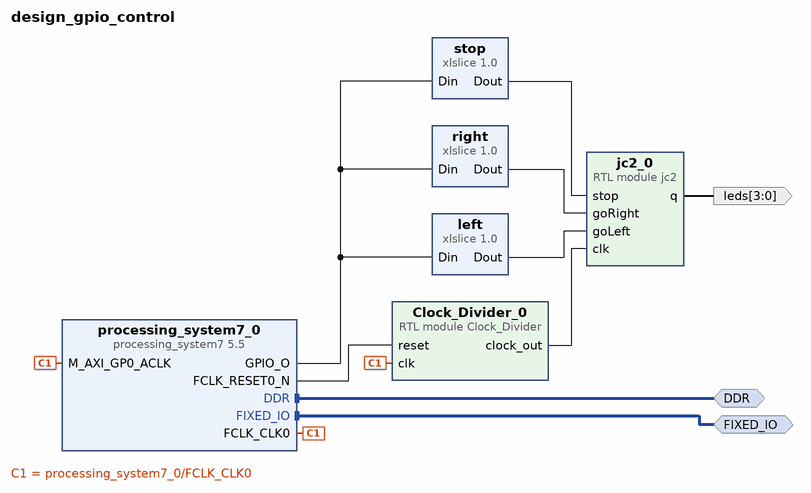
[diagram p0: block diagram of the top level]
# Vivado block design design_gpio_control, xc7z020clg400-1, Vivado 2019.1
create_bd_design design_gpio_control

create_bd_intf_port -mode Master -vlnv xilinx.com:interface:ddrx_rtl:1.0 DDR
create_bd_intf_port -mode Master -vlnv xilinx.com:display_processing_system7:fixedio_rtl:1.0 FIXED_IO
create_bd_port -dir O -from 3 -to 0 leds

create_bd_cell -type ip -vlnv xilinx.com:ip:processing_system7:5.5 processing_system7_0
set_property -dict [list \
  CONFIG.PCW_APU_PERIPHERAL_FREQMHZ 650 \
  CONFIG.PCW_CRYSTAL_PERIPHERAL_FREQMHZ 50 \
  CONFIG.PCW_ENET0_ENET0_IO {MIO 16 .. 27} \
  CONFIG.PCW_ENET0_GRP_MDIO_ENABLE 1 \
  CONFIG.PCW_ENET0_GRP_MDIO_IO {MIO 52 .. 53} \
  CONFIG.PCW_ENET0_PERIPHERAL_ENABLE 1 \
  CONFIG.PCW_ENET0_RESET_ENABLE 1 \
  CONFIG.PCW_ENET0_RESET_IO {MIO 9} \
  CONFIG.PCW_ENET_RESET_ENABLE 1 \
  CONFIG.PCW_ENET_RESET_SELECT {Share reset pin} \
  CONFIG.PCW_FPGA0_PERIPHERAL_FREQMHZ 100 \
  CONFIG.PCW_FPGA1_PERIPHERAL_FREQMHZ 50 \
  CONFIG.PCW_GPIO_EMIO_GPIO_ENABLE 1 \
  CONFIG.PCW_GPIO_EMIO_GPIO_IO 64 \
  CONFIG.PCW_GPIO_MIO_GPIO_ENABLE 1 \
  CONFIG.PCW_GPIO_MIO_GPIO_IO MIO \
  CONFIG.PCW_I2C_RESET_ENABLE 1 \
  CONFIG.PCW_M_AXI_GP0_FREQMHZ 10 \
  CONFIG.PCW_PERIPHERAL_BOARD_PRESET None \
  CONFIG.PCW_PRESET_BANK1_VOLTAGE {LVCMOS 1.8V} \
  CONFIG.PCW_QSPI_GRP_FBCLK_ENABLE 1 \
  CONFIG.PCW_QSPI_GRP_FBCLK_IO {MIO 8} \
  CONFIG.PCW_QSPI_GRP_SINGLE_SS_ENABLE 1 \
  CONFIG.PCW_QSPI_GRP_SINGLE_SS_IO {MIO 1 .. 6} \
  CONFIG.PCW_QSPI_PERIPHERAL_ENABLE 1 \
  CONFIG.PCW_QSPI_QSPI_IO {MIO 1 .. 6} \
  CONFIG.PCW_SD0_GRP_CD_ENABLE 1 \
  CONFIG.PCW_SD0_GRP_CD_IO {MIO 47} \
  CONFIG.PCW_SD0_GRP_WP_ENABLE 0 \
  CONFIG.PCW_SD0_PERIPHERAL_ENABLE 1 \
  CONFIG.PCW_SD0_SD0_IO {MIO 40 .. 45} \
  CONFIG.PCW_SDIO_PERIPHERAL_FREQMHZ 50 \
  CONFIG.PCW_SINGLE_QSPI_DATA_MODE x4 \
  CONFIG.PCW_UART0_PERIPHERAL_ENABLE 1 \
  CONFIG.PCW_UART0_UART0_IO {MIO 14 .. 15} \
  CONFIG.PCW_UART1_PERIPHERAL_ENABLE 0 \
  CONFIG.PCW_UART_PERIPHERAL_FREQMHZ 100 \
  CONFIG.PCW_UIPARAM_DDR_BUS_WIDTH {16 Bit} \
  CONFIG.PCW_UIPARAM_DDR_FREQ_MHZ 525 \
  CONFIG.PCW_UIPARAM_DDR_PARTNO {MT41J256M16 RE-125} \
  CONFIG.PCW_USB0_PERIPHERAL_ENABLE 1 \
  CONFIG.PCW_USB0_RESET_ENABLE 1 \
  CONFIG.PCW_USB0_RESET_IO {MIO 46} \
  CONFIG.PCW_USB0_USB0_IO {MIO 28 .. 39} \
  CONFIG.PCW_USB_RESET_ENABLE 1 \
  CONFIG.PCW_USB_RESET_SELECT {Share reset pin} \
] [get_bd_cells processing_system7_0]
# 481 more settings of processing_system7_0 are not shown: defaults, MIO pin electricals, DDR timing, and values the tool derives
create_bd_cell -type module -reference jc2 jc2_0
create_bd_cell -type module -reference Clock_Divider Clock_Divider_0
create_bd_cell -type ip -vlnv xilinx.com:ip:xlslice:1.0 left
set_property -dict {CONFIG.DIN_FROM 0 CONFIG.DIN_TO 0 CONFIG.DIN_WIDTH 64} [get_bd_cells left]
create_bd_cell -type ip -vlnv xilinx.com:ip:xlslice:1.0 right
set_property -dict {CONFIG.DIN_FROM 1 CONFIG.DIN_TO 1 CONFIG.DIN_WIDTH 64 CONFIG.DOUT_WIDTH 1} [get_bd_cells right]
create_bd_cell -type ip -vlnv xilinx.com:ip:xlslice:1.0 stop
set_property -dict {CONFIG.DIN_FROM 2 CONFIG.DIN_TO 2 CONFIG.DIN_WIDTH 64 CONFIG.DOUT_WIDTH 1} [get_bd_cells stop]

# ---- connections ----

connect_bd_intf_net [get_bd_intf_ports DDR] [get_bd_intf_pins processing_system7_0/DDR]
connect_bd_intf_net [get_bd_intf_ports FIXED_IO] [get_bd_intf_pins processing_system7_0/FIXED_IO]
connect_bd_net [get_bd_pins jc2_0/q] [get_bd_ports leds]
connect_bd_net [get_bd_pins processing_system7_0/FCLK_CLK0] [get_bd_pins Clock_Divider_0/clk] [get_bd_pins processing_system7_0/M_AXI_GP0_ACLK]
connect_bd_net [get_bd_pins processing_system7_0/FCLK_RESET0_N] [get_bd_pins Clock_Divider_0/reset]
connect_bd_net [get_bd_pins Clock_Divider_0/clock_out] [get_bd_pins jc2_0/clk]
connect_bd_net [get_bd_pins processing_system7_0/GPIO_O] [get_bd_pins left/Din] [get_bd_pins right/Din] [get_bd_pins stop/Din]
connect_bd_net [get_bd_pins left/Dout] [get_bd_pins jc2_0/goLeft]
connect_bd_net [get_bd_pins right/Dout] [get_bd_pins jc2_0/goRight]
connect_bd_net [get_bd_pins stop/Dout] [get_bd_pins jc2_0/stop]

validate_bd_design
save_bd_design
